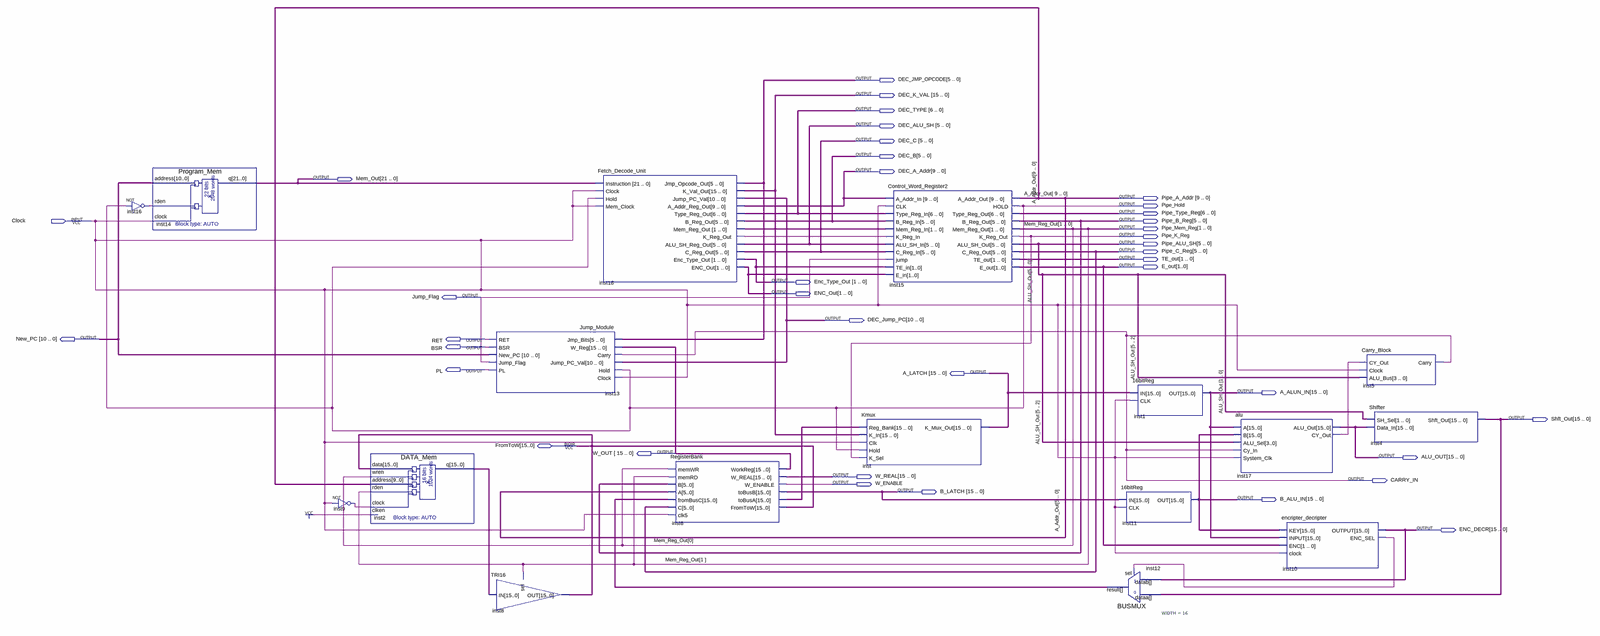
[diagram p0: schematic sheet, whole]
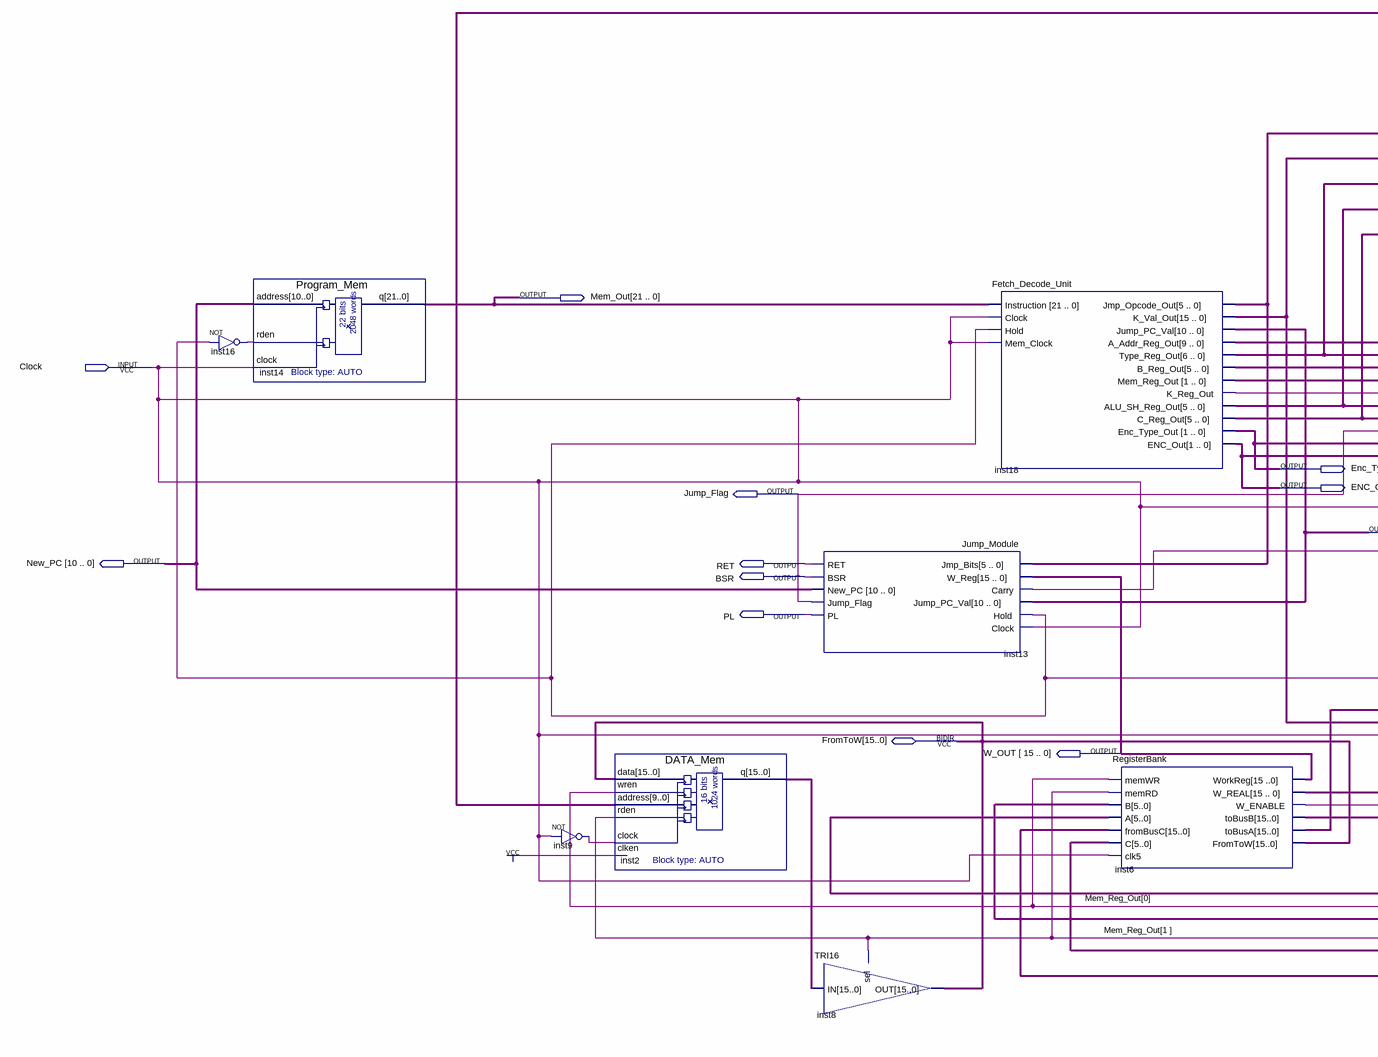
[diagram p1: schematic sheet, left part]
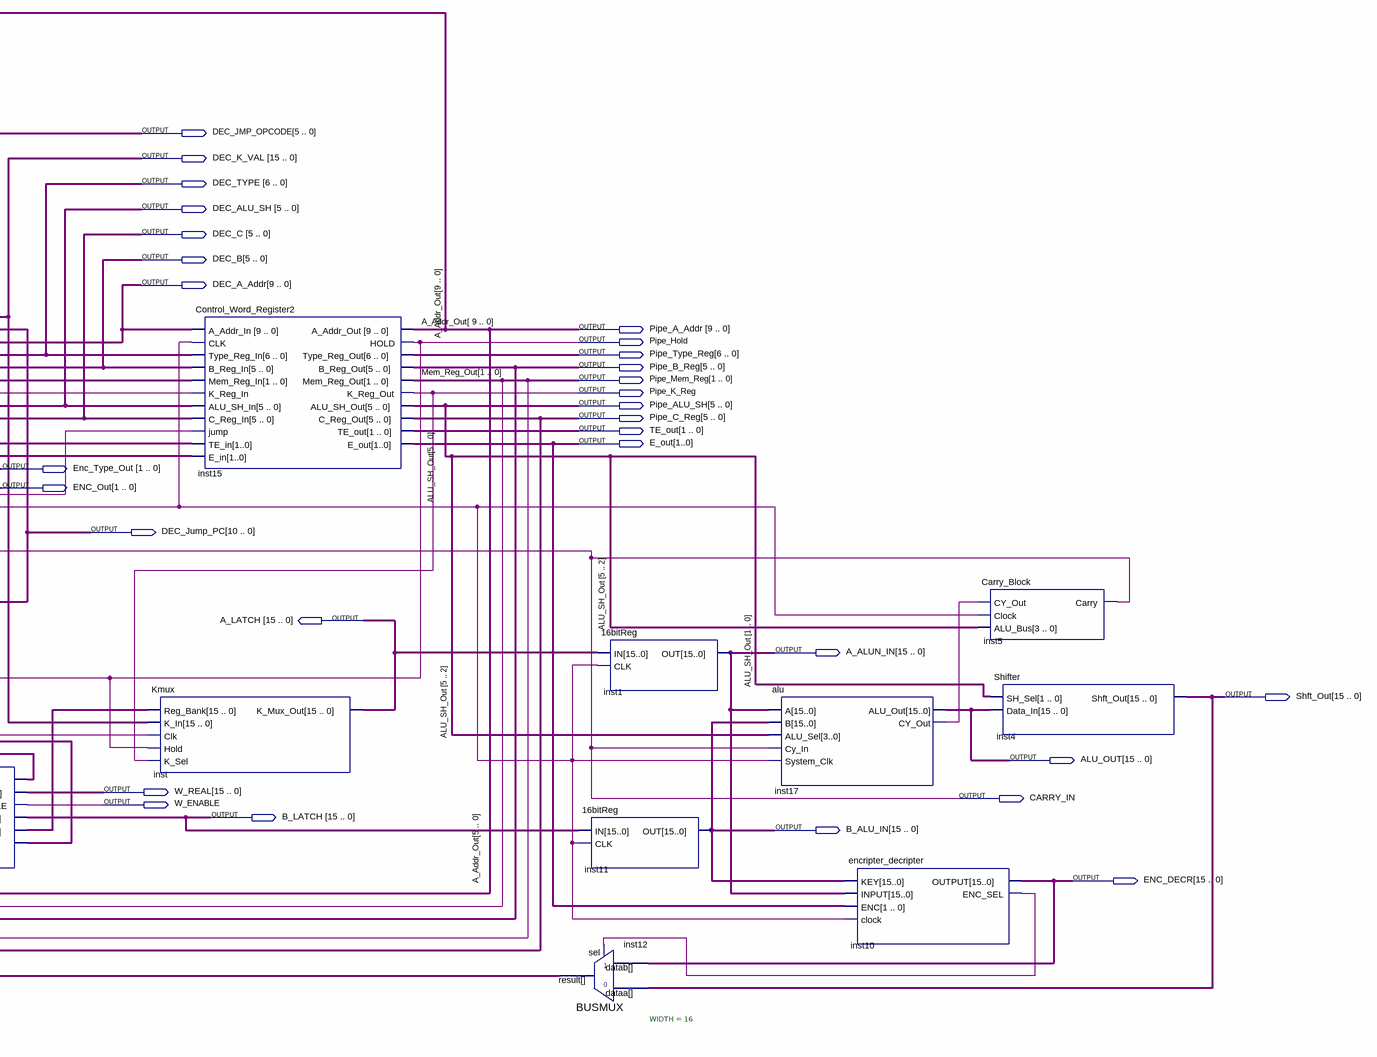
[diagram p2: schematic sheet, right part]
// Quartus schematic TP2_E5.bdf as structural Verilog: 17 symbols, 39 pins
module TP2_E5 (
  input  Clock,
  inout  [15:0] FromToW,
  output [5:0] DEC_JMP_OPCODE,
  output [15:0] DEC_K_VAL,
  output [6:0] DEC_TYPE,
  output [5:0] DEC_ALU_SH,
  output [5:0] DEC_C,
  output [5:0] DEC_B,
  output [9:0] DEC_A_Addr,
  output [21:0] Mem_Out,
  output [9:0] Pipe_A_Addr,
  output Pipe_Hold,
  output [6:0] Pipe_Type_Reg,
  output [5:0] Pipe_B_Reg,
  output [1:0] Pipe_Mem_Reg,
  output Pipe_K_Reg,
  output [5:0] Pipe_ALU_SH,
  output [5:0] Pipe_C_Reg,
  output [1:0] TE_out,
  output [1:0] E_out,
  output [1:0] Enc_Type_Out,
  output [1:0] ENC_Out,
  output Jump_Flag,
  output [10:0] DEC_Jump_PC,
  output [10:0] New_PC,
  output RET,
  output BSR,
  output PL,
  output [15:0] A_LATCH,
  output [15:0] A_ALUN_IN,
  output [15:0] Shft_Out,
  output [15:0] W_OUT,
  output [15:0] ALU_OUT,
  output [15:0] W_REAL,
  output CARRY_IN,
  output W_ENABLE,
  output [15:0] B_LATCH,
  output [15:0] B_ALU_IN,
  output [15:0] ENC_DECR
);

  wire inst9_out, inst10_enc_sel, inst16_out, inst17_cy_out, inst18_k_reg_out;
  wire [1:0] inst18_mem_reg_out;
  wire [15:0] inst2_q, inst6_tobusa, inst12_result;

  not inst16 (inst16_out, Pipe_Hold);
  Program_Mem inst14 (.address(New_PC), .rden(inst16_out), .clock(Clock), .q(Mem_Out));
  not inst9 (inst9_out, Clock);
  DATA_Mem inst2 (
    .data(FromToW), .wren(Pipe_Mem_Reg[0]), .address(Pipe_A_Addr), .rden(Pipe_Mem_Reg[1]), .clock(inst9_out),
    .clken(1'b1), .q(inst2_q));
  Jump_Module inst13 (
    .Jmp_Bits(DEC_JMP_OPCODE), .W_Reg(W_OUT), .Carry(CARRY_IN), .Jump_PC_Val(DEC_Jump_PC), .Hold(Pipe_Hold),
    .Clock(Clock), .RET(RET), .BSR(BSR), .New_PC(New_PC), .Jump_Flag(Jump_Flag), .PL(PL));
  TRI16 inst8 (.sel(Pipe_Mem_Reg[1]), .IN(inst2_q), .OUT(FromToW));
  Fetch_Decode_Unit inst18 (
    .Instruction(Mem_Out), .Clock(Clock), .Hold(Pipe_Hold), .Mem_Clock(Clock),
    .Jmp_Opcode_Out(DEC_JMP_OPCODE), .K_Val_Out(DEC_K_VAL), .Jump_PC_Val(DEC_Jump_PC),
    .A_Addr_Reg_Out(DEC_A_Addr), .Type_Reg_Out(DEC_TYPE), .B_Reg_Out(DEC_B),
    .Mem_Reg_Out(inst18_mem_reg_out), .K_Reg_Out(inst18_k_reg_out), .ALU_SH_Reg_Out(DEC_ALU_SH),
    .C_Reg_Out(DEC_C), .Enc_Type_Out(Enc_Type_Out), .ENC_Out(ENC_Out));
  RegisterBank inst6 (
    .memWR(Pipe_Mem_Reg[0]), .memRD(Pipe_Mem_Reg[1]), .B(Pipe_B_Reg), .A(Pipe_A_Addr[5:0]),
    .fromBusC(inst12_result), .C(Pipe_C_Reg), .clk5(Clock), .WorkReg(W_OUT), .W_REAL(W_REAL),
    .W_ENABLE(W_ENABLE), .toBusB(B_LATCH), .toBusA(inst6_tobusa), .FromToW(FromToW));
  Kmux inst (
    .Reg_Bank(inst6_tobusa), .K_In(DEC_K_VAL), .Clk(Clock), .Hold(Pipe_Hold), .K_Sel(Pipe_K_Reg),
    .K_Mux_Out(A_LATCH));
  Control_Word_Register2 inst15 (
    .A_Addr_In(DEC_A_Addr), .CLK(Clock), .Type_Reg_In(DEC_TYPE), .B_Reg_In(DEC_B),
    .Mem_Reg_In(inst18_mem_reg_out), .K_Reg_In(inst18_k_reg_out), .ALU_SH_In(DEC_ALU_SH), .C_Reg_In(DEC_C),
    .jump(Jump_Flag), .TE_in(Enc_Type_Out), .E_in(ENC_Out), .A_Addr_Out(Pipe_A_Addr), .HOLD(Pipe_Hold),
    .Type_Reg_Out(Pipe_Type_Reg), .B_Reg_Out(Pipe_B_Reg), .Mem_Reg_Out(Pipe_Mem_Reg), .K_Reg_Out(Pipe_K_Reg),
    .ALU_SH_Out(Pipe_ALU_SH), .C_Reg_Out(Pipe_C_Reg), .TE_out(TE_out), .E_out(E_out));
  \16bitReg  inst1 (.IN(A_LATCH), .CLK(Clock), .OUT(A_ALUN_IN));
  \16bitReg  inst11 (.IN(B_LATCH), .CLK(Clock), .OUT(B_ALU_IN));
  BUSMUX #(.WIDTH(16)) inst12 (.datab(ENC_DECR), .sel(inst10_enc_sel), .dataa(Shft_Out), .result(inst12_result));
  alu inst17 (
    .A(A_ALUN_IN), .B(B_ALU_IN), .ALU_Sel(Pipe_ALU_SH[5:2]), .Cy_In(CARRY_IN), .System_Clk(Clock),
    .ALU_Out(ALU_OUT), .CY_Out(inst17_cy_out));
  encripter_decripter inst10 (
    .KEY(B_ALU_IN), .INPUT(A_ALUN_IN), .ENC(E_out), .clock(Clock), .OUTPUT(ENC_DECR), .ENC_SEL(inst10_enc_sel));
  Carry_Block inst5 (.CY_Out(inst17_cy_out), .Clock(Clock), .ALU_Bus(Pipe_ALU_SH[5:2]), .Carry(CARRY_IN));
  Shifter inst4 (.SH_Sel(Pipe_ALU_SH[1:0]), .Data_In(ALU_OUT), .Shft_Out(Shft_Out));

  // Other names for the same wires on the sheet: A_Addr_Out[9:0] = Pipe_A_Addr; ALU_SH_Out[5:0] = Pipe_ALU_SH;
  //   Mem_Reg_Out[1:0] = Pipe_Mem_Reg
endmodule
